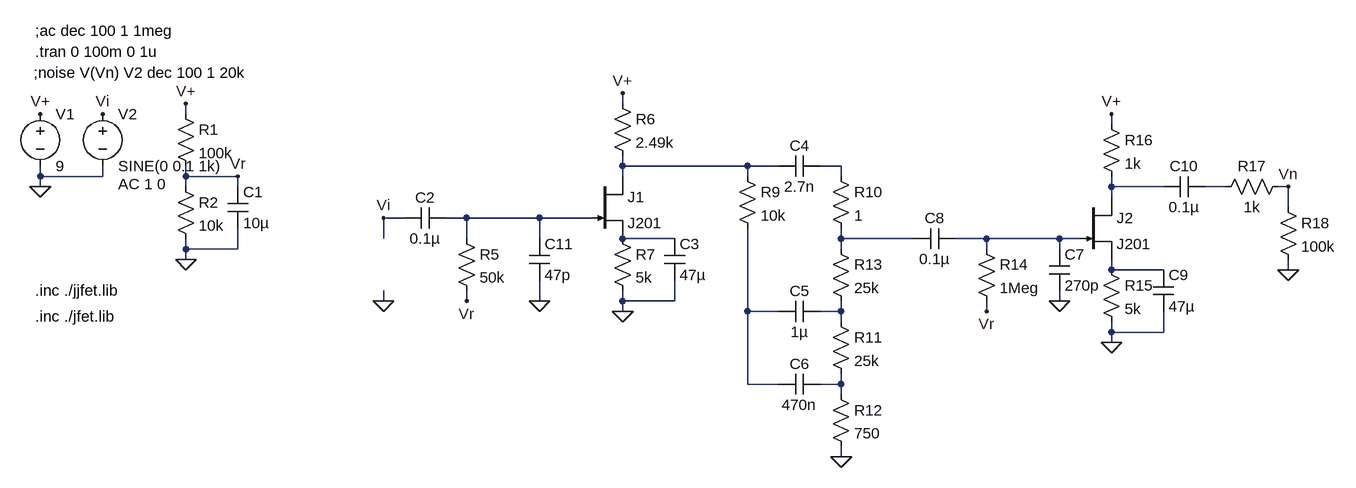
[diagram p0: schematic SADOWSKY_DI.asc]
SADOWSKY_DI.asc, the LTspice schematic file:
Version 4
SHEET 1 2108 680
WIRE 896 80 896 64
WIRE 224 96 224 80
WIRE 1648 112 1648 96
WIRE 896 176 896 160
WIRE 1088 176 896 176
WIRE 1136 176 1088 176
WIRE 1232 176 1200 176
WIRE 0 192 0 176
WIRE 96 192 96 176
WIRE 96 192 0 192
WIRE 224 192 224 176
WIRE 304 192 224 192
WIRE 896 192 896 176
WIRE 1088 192 1088 176
WIRE 1232 192 1232 176
WIRE 0 208 0 192
WIRE 224 208 224 192
WIRE 304 208 304 192
WIRE 1648 208 1648 192
WIRE 1728 208 1648 208
WIRE 1824 208 1792 208
WIRE 1920 208 1904 208
WIRE 1648 224 1648 208
WIRE 1920 240 1920 208
WIRE 560 256 528 256
WIRE 656 256 624 256
WIRE 768 256 656 256
WIRE 848 256 768 256
WIRE 528 288 528 256
WIRE 656 288 656 256
WIRE 768 288 768 256
WIRE 976 288 896 288
WIRE 1232 288 1232 272
WIRE 1344 288 1232 288
WIRE 1456 288 1408 288
WIRE 1568 288 1456 288
WIRE 1600 288 1568 288
WIRE 224 304 224 288
WIRE 304 304 304 272
WIRE 304 304 224 304
WIRE 1232 304 1232 288
WIRE 1456 304 1456 288
WIRE 1568 304 1568 288
WIRE 224 320 224 304
WIRE 1648 336 1648 320
WIRE 1728 336 1648 336
WIRE 1920 336 1920 320
WIRE 528 384 528 368
WIRE 656 384 656 368
WIRE 768 384 768 352
WIRE 896 384 896 368
WIRE 976 384 976 352
WIRE 976 384 896 384
WIRE 1568 384 1568 368
WIRE 896 400 896 384
WIRE 1088 400 1088 272
WIRE 1136 400 1088 400
WIRE 1232 400 1232 384
WIRE 1232 400 1200 400
WIRE 1456 400 1456 384
WIRE 1232 416 1232 400
WIRE 1648 432 1648 416
WIRE 1728 432 1728 400
WIRE 1728 432 1648 432
WIRE 1648 448 1648 432
WIRE 1088 512 1088 400
WIRE 1136 512 1088 512
WIRE 1232 512 1232 496
WIRE 1232 512 1200 512
WIRE 1232 528 1232 512
WIRE 1232 624 1232 608
FLAG 0 208 0
FLAG 0 96 V+
FLAG 96 96 Vi
FLAG 224 320 0
FLAG 224 80 V+
FLAG 528 384 0
FLAG 304 192 Vr
FLAG 656 384 Vr
FLAG 896 400 0
FLAG 896 64 V+
FLAG 1232 624 0
FLAG 1568 384 0
FLAG 1456 400 Vr
FLAG 1648 448 0
FLAG 1648 96 V+
FLAG 1920 336 0
FLAG 768 384 0
FLAG 528 256 Vi
FLAG 1920 208 Vn
SYMBOL voltage 0 80 R0
SYMATTR InstName V1
SYMATTR Value 9
SYMBOL voltage 96 80 R0
WINDOW 123 24 124 Left 2
WINDOW 39 0 0 Left 2
SYMATTR Value2 AC 1 0
SYMATTR InstName V2
SYMATTR Value SINE(0 0.1 1k)
SYMBOL res 208 80 R0
SYMATTR InstName R1
SYMATTR Value 100k
SYMBOL res 208 192 R0
SYMATTR InstName R2
SYMATTR Value 10k
SYMBOL cap 288 208 R0
SYMATTR InstName C1
SYMATTR Value 10µ
SYMBOL cap 624 240 R90
WINDOW 0 0 32 VBottom 2
WINDOW 3 32 32 VTop 2
SYMATTR InstName C2
SYMATTR Value 0.1µ
SYMBOL res 640 272 R0
SYMATTR InstName R5
SYMATTR Value 50k
SYMBOL njf 848 192 R0
SYMATTR InstName J1
SYMATTR Value J201
SYMBOL res 880 64 R0
SYMATTR InstName R6
SYMATTR Value 2.49k
SYMBOL res 880 272 R0
SYMATTR InstName R7
SYMATTR Value 5k
SYMBOL cap 960 288 R0
SYMATTR InstName C3
SYMATTR Value 47µ
SYMBOL res 1072 176 R0
SYMATTR InstName R9
SYMATTR Value 10k
SYMBOL res 1216 176 R0
SYMATTR InstName R10
SYMATTR Value 1
SYMBOL res 1216 400 R0
SYMATTR InstName R11
SYMATTR Value 25k
SYMBOL res 1216 512 R0
SYMATTR InstName R12
SYMATTR Value 750
SYMBOL cap 1200 160 R90
WINDOW 0 0 32 VBottom 2
WINDOW 3 32 32 VTop 2
SYMATTR InstName C4
SYMATTR Value 2.7n
SYMBOL cap 1200 384 R90
WINDOW 0 0 32 VBottom 2
WINDOW 3 32 32 VTop 2
SYMATTR InstName C5
SYMATTR Value 1µ
SYMBOL cap 1200 496 R90
WINDOW 0 0 32 VBottom 2
WINDOW 3 32 32 VTop 2
SYMATTR InstName C6
SYMATTR Value 470n
SYMBOL res 1216 288 R0
SYMATTR InstName R13
SYMATTR Value 25k
SYMBOL njf 1600 224 R0
SYMATTR InstName J2
SYMATTR Value J201
SYMBOL res 1440 288 R0
SYMATTR InstName R14
SYMATTR Value 1Meg
SYMBOL cap 1552 304 R0
SYMATTR InstName C7
SYMATTR Value 270p
SYMBOL cap 1408 272 R90
WINDOW 0 0 32 VBottom 2
WINDOW 3 32 32 VTop 2
SYMATTR InstName C8
SYMATTR Value 0.1µ
SYMBOL res 1632 320 R0
SYMATTR InstName R15
SYMATTR Value 5k
SYMBOL cap 1712 336 R0
SYMATTR InstName C9
SYMATTR Value 47µ
SYMBOL res 1632 96 R0
SYMATTR InstName R16
SYMATTR Value 1k
SYMBOL cap 1792 192 R90
WINDOW 0 0 32 VBottom 2
WINDOW 3 32 32 VTop 2
SYMATTR InstName C10
SYMATTR Value 0.1µ
SYMBOL res 1920 192 R90
WINDOW 0 0 56 VBottom 2
WINDOW 3 32 56 VTop 2
SYMATTR InstName R17
SYMATTR Value 1k
SYMBOL res 1904 224 R0
SYMATTR InstName R18
SYMATTR Value 100k
SYMBOL cap 752 288 R0
SYMATTR InstName C11
SYMATTR Value 47p
TEXT -8 368 Left 2 !.inc ./jjfet.lib
TEXT -8 -32 Left 2 !;ac dec 100 1 1meg
TEXT -8 0 Left 2 !.tran 0 100m 0 1u
TEXT -8 408 Left 2 !.inc ./jfet.lib
TEXT -10 32 Left 2 !;noise V(Vn) V2 dec 100 1 20k

The netlist it stands for:
* SADOWSKY_DI.asc
V1 V+ 0 9
V2 Vi 0 SINE(0 0.1 1k) AC 1 0
R1 V+ Vr 100k
R2 Vr 0 10k
C1 Vr 0 10µ
C2 N005 Vi 0.1µ
R5 N005 Vr 50k
J1 N001 N005 N006 J201
R6 V+ N001 2.49k
R7 N006 0 5k
C3 N006 0 47µ
R9 N001 N010 10k
R10 N002 N007 1
R11 N011 N012 25k
R12 N012 0 750
C4 N002 N001 2.7n
C5 N011 N010 1µ
C6 N012 N010 470n
R13 N007 N011 25k
J2 N003 N008 N009 J201
R14 N008 Vr 1Meg
C7 N008 0 270p
C8 N008 N007 0.1µ
R15 N009 0 5k
C9 N009 0 47µ
R16 V+ N003 1k
C10 N004 N003 0.1µ
R17 Vn N004 1k
R18 Vn 0 100k
C11 N005 0 47p
.model NJF NJF
.model PJF PJF
.lib standard.jft
.inc ./jjfet.lib
;ac dec 100 1 1meg
.tran 0 100m 0 1u
.inc ./jfet.lib
;noise V(Vn) V2 dec 100 1 20k
.backanno
.end